# Altium schematic sheet Isolator.SchDoc
size 193 x 146 mm; DocumentNumber: 8; SheetNumber: 8; SheetTotal: 11
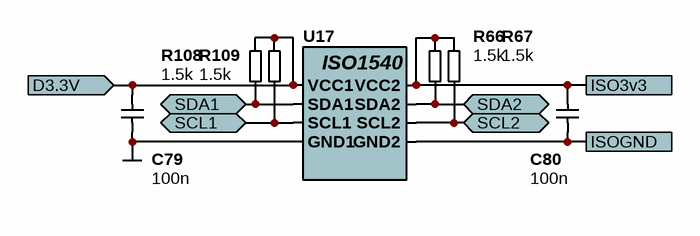
[diagram p0: Isolator.SchDoc]

## Parts
C79  100n  [0402-Capacitor]  (net tie, no BOM)
C80  100n  [0402-Capacitor]  (net tie, no BOM)
R66  1.5k  [0603-RESISTOR]
R67  1.5k  [0603-RESISTOR]
R108  1.5k  [0603-RESISTOR]
R109  1.5k  [0603-RESISTOR]
U17  ISO1540DR  [SOIC8]  (value not drawn)

## Ports
D3.3V (in), ISO3v3, ISOGND, SCL1 (bidir), SCL2 (bidir), SDA1 (bidir), SDA2 (bidir)

## Nets
DGND: C79.1 U17.4(GND1)
D3.3V: C79.2 R108.1 R109.1 U17.1(VCC1) ; port D3.3V
ISO3v3: C80.2 R66.1 R67.1 U17.8(VCC2) ; port ISO3v3
ISOGND: C80.1 U17.5(GND2) ; port ISOGND
SCL1: R109.2 U17.3(SCL1) ; port SCL1
SCL2: R67.2 U17.6(SCL2) ; port SCL2
SDA1: R108.2 U17.2(SDA1) ; port SDA1
SDA2: R66.2 U17.7(SDA2) ; port SDA2

## Notes on the sheet
- Title
- Project
- Drawing no.
- Date
- Drawn by
- Checked by
- Revision
- (in symbol ISO1540DR) ISO1540

## Library data of the parts
C79 C80 = C_0402: Capacitor 0402; Tolerance: ±20%; Voltage Rating: 16V; Dielectric: X7R/C0G; Value: 100n; Case: 0402
R66 R67 R108 R109 = R_0603: Resistor 0603; Tolerance: ±1%; Value: 1.5k; Case: 0603
U17 = ISO1540DR: 12 Weeks / Detailed Description I²C Digital Isolator 2500Vrms 2 Channel 1Mbps 25kV/µs CMTI 8-SOIC (0.154", 3.90mm Width); HelpURL: http://www.ti.com/lit/ds/symlink/iso1540.pdf; Case: 8-SOIC; Supplier 1: Digi-Key; Supplier Part Number 1: 296-34871-1-ND